# Altium schematic sheet LTC6811_Sheet.SchDoc
size A4; Organization: Waterloop; Address1: 200 University Ave W; Address2: Engineering 5, 1104; Address3: Waterloo, ON; Address4: N2L 3G1; SheetNumber: 3; SheetTotal: 5
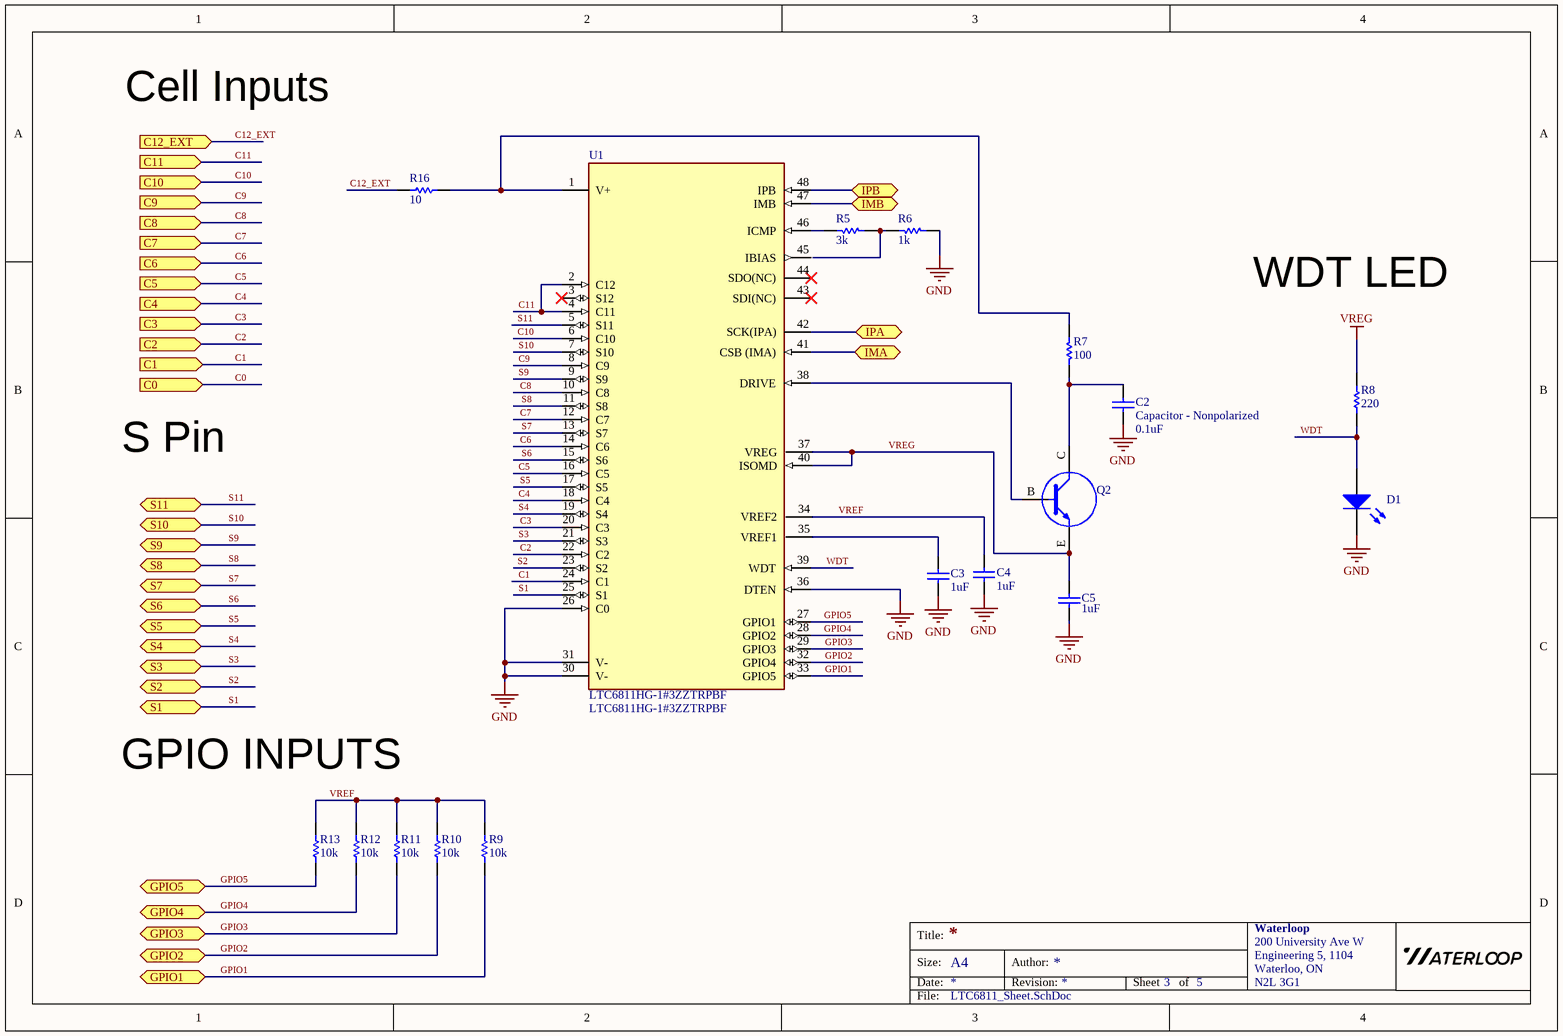
[diagram p0: LTC6811_Sheet.SchDoc]

## Parts
C2  Capacitor - Nonpolarized  value 0.1uF  [0603 - Capacitor]
C3  value 1uF  [0603 - Capacitor]  (hidden comment: Capacitor - Nonpolarized)
C4  value 1uF  [0603 - Capacitor]  (hidden comment: Capacitor - Nonpolarized)
C5  value 1uF  [0603 - Capacitor]  (hidden comment: Capacitor - Nonpolarized)
D1  LED  [0805 - DIODE]  (value not drawn)
Q2  TRANS NPN 160V 0.6A POWERDI5  [DXT5551P5]  (value not drawn)
R5  value 3k  [0603 - Resistor]  (hidden comment: Resistor)
R6  value 1k  [0603 - Resistor]  (hidden comment: Resistor)
R7  value 100  [0603 - Resistor]  (hidden comment: Resistor)
R8  value 220  [0603 - Resistor]  (hidden comment: Resistor)
R9  value 10k  [0603 - Resistor]  (hidden comment: Resistor)
R10  value 10k  [0603 - Resistor]  (hidden comment: Resistor)
R11  value 10k  [0603 - Resistor]  (hidden comment: Resistor)
R12  value 10k  [0603 - Resistor]  (hidden comment: Resistor)
R13  value 10k  [0603 - Resistor]  (hidden comment: Resistor)
R16  value 10  [0603 - Resistor]  (hidden comment: Resistor)
U1  LTC6811HG-1#3ZZTRPBF  [LTC6811-1]

## Ports
C0 (in, see Monitoring IC[3C]), C1 (in, see Monitoring IC[3B]), C2 (in, see Monitoring IC[3B]), C3 (in, see Monitoring IC[3B]), C4 (in, see Monitoring IC[3B]), C5 (in, see Monitoring IC[3B]), C6 (in, see Monitoring IC[2B]), C7 (in, see Monitoring IC[2B]), C8 (in, see Monitoring IC[2B]), C9 (in, see Monitoring IC[2B]), C10 (in, see Monitoring IC[2B]), C11 (in, see Monitoring IC[2B]), C12_EXT (in, see Monitoring IC[2B]), GPIO1 (bidir, see Monitoring IC[2A]), GPIO2 (bidir, see Monitoring IC[2A]), GPIO3 (bidir, see Monitoring IC[2B]), GPIO4 (bidir, see Monitoring IC[2B]), GPIO5 (bidir, see Monitoring IC[2B]), IMA (bidir, see Monitoring IC[3B]), IMB (bidir, see Monitoring IC[3A]), IPA (bidir, see Monitoring IC[3B]), IPB (bidir, see Monitoring IC[3A]), S1 (bidir, see Monitoring IC[3B]), S2 (bidir, see Monitoring IC[3B]), S3 (bidir, see Monitoring IC[3B]), S4 (bidir, see Monitoring IC[3B]), S5 (bidir, see Monitoring IC[3B]), S6 (bidir, see Monitoring IC[2C]), S7 (bidir, see Monitoring IC[2B]), S8 (bidir, see Monitoring IC[2B]), S9 (bidir, see Monitoring IC[2B]), S10 (bidir, see Monitoring IC[2B]), S11 (bidir, see Monitoring IC[2B])

## Nets
GND: C2.1 C3.1 C4.1 C5.1 D1.2(K) R6.1 U1.26(C0) U1.30(V-) U1.31(V-) U1.36(DTEN)
VREG: C5.2 Q2.E R8.2 U1.37(VREG) U1.40(ISOMD)
C0: port C0
C1: U1.24(C1) ; port C1
C2: U1.22(C2) ; port C2
C3: U1.20(C3) ; port C3
C4: U1.18(C4) ; port C4
C5: U1.16(C5) ; port C5
C6: U1.14(C6) ; port C6
C7: U1.12(C7) ; port C7
C8: U1.10(C8) ; port C8
C9: U1.8(C9) ; port C9
C10: U1.6(C10) ; port C10
C11: U1.2(C12) U1.4(C11) ; port C11
C12_EXT: R16.1 ; port C12_EXT
GPIO1: R9.1 U1.33(GPIO5) ; port GPIO1
GPIO2: R10.1 U1.32(GPIO4) ; port GPIO2
GPIO3: R11.1 U1.29(GPIO3) ; port GPIO3
GPIO4: R12.1 U1.28(GPIO2) ; port GPIO4
GPIO5: R13.1 U1.27(GPIO1) ; port GPIO5
IMA: U1.41(CSB_(IMA)) ; port IMA
IMB: U1.47(IMB) ; port IMB
IPA: U1.42(SCK(IPA)) ; port IPA
IPB: U1.48(IPB) ; port IPB
S1: U1.25(S1) ; port S1
S2: U1.23(S2) ; port S2
S3: U1.21(S3) ; port S3
S4: U1.19(S4) ; port S4
S5: U1.17(S5) ; port S5
S6: U1.15(S6) ; port S6
S7: U1.13(S7) ; port S7
S8: U1.11(S8) ; port S8
S9: U1.9(S9) ; port S9
S10: U1.7(S10) ; port S10
S11: U1.5(S11) ; port S11
VREF: C4.2 R9.2 R10.2 R11.2 R12.2 R13.2 U1.34(VREF2)
WDT: D1.1(A) R8.1 U1.39(WDT)
NetC2_2: C2.2 Q2.C R7.2
NetC3_2: C3.2 U1.35(VREF1)
NetQ2_B: Q2.B U1.38(DRIVE)
NetR5_1: R5.1 R6.2
NetR5_2: R5.2 U1.46(ICMP)
NetR7_1: R7.1 R16.2 U1.1(V+)

Not connected (* = marked no-connect by the designer): U1 3(S12)* 43(SDI(NC))* 44(SDO(NC))* 45(IBIAS)

## Notes on the sheet
- Cell Inputs
- WDT LED
- S Pin
- GPIO INPUTS
- Title:
- Size:
- Date:
- A4
- Author:
- Revision:
- Sheet
- of
- File:

## Library data of the parts
C2-C5 = Capacitor - Nonpolarized: Nonpolarized Capacitor; Supplier Part Number: *; Supplier: *; Manufacturer: *; Rating: *; Manufacturer Part Number: *
D1 = LED: Light Emitting Diode; Value: *; Manufacturer Part Number: *; Manufacturer: *; Supplier Part Number: *; Rating: *; Supplier: *
Q2 = DXT5551P5-13: Bipolar (BJT) Transistor NPN 160 V 600 mA 130MHz 2.25 W Surface Mount PowerDI™ 5
U1 = LTC6811HG-1#3ZZTRPBF: Multicell Battery Balancer 5.7V Automotive 48-Pin SSOP T/R; Manufacturer: Analog Devices / Linear Technology; Analog IC - Other Type: POWER SUPPLY MANAGEMENT CIRCUIT; Supplier 1: Mouser; RoHS: Yes; Category: Battery Management; Pricing 1: 1=21.45000, 10=19.72000, 25=18.91000, 50=18.91000, 100=18.91000, 111=16.65000, 1000=16.65000, 10000=16.65000 (USD); REACH SVHC: Yes; RoHS Compliant: Yes; ComponentLink1URL: https://www.analog.com/media/en/technical-documentation/data-sheets/LTC6811-1-6811-2.pdf; ComponentLink1Description: https://datasheet.ciiva.com:443/pdfs/VipMasterIC/IC/LITC/LITC-S-A0003389121/LITC-S-A0003389121-1.pdf?src-supplier=IHS+Markit; Manufacturer Part Number: LTC6811HG-1#3ZZTRPBF; Supplier 2: Mouser; Supplier Part Number 2: 584-6811HG-1#3ZZTRPB; Pricing 2: 1=22.70000, 10=20.93000, 50=20.00000, 100=17.88000, 1000=16.64000, 10000=16.64000 (USD)
R5-R13 R16 = Resistor: Rating: *; Manufacturer Part Number: *; Manufacturer: *; Supplier Part Number: *; Supplier: *